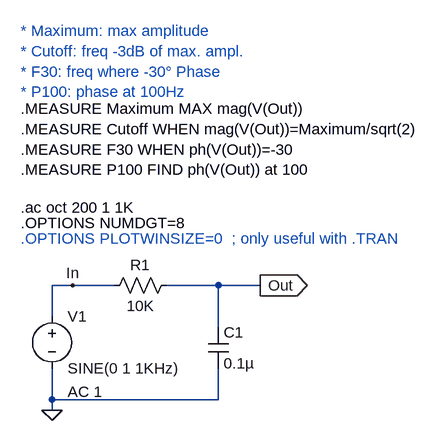
[diagram p0: schematic Phase_shift_lowpass1.asc]
Phase_shift_lowpass1.asc, the LTspice schematic file:
Version 4
SHEET 1 1544 680
WIRE 48 112 16 112
WIRE 112 112 48 112
WIRE 272 112 192 112
WIRE 336 112 272 112
WIRE 16 160 16 112
WIRE 272 176 272 112
WIRE 16 288 16 240
WIRE 272 288 272 240
WIRE 272 288 16 288
WIRE 16 304 16 288
FLAG 16 304 0
FLAG 336 112 Out
IOPIN 336 112 Out
FLAG 48 112 In
SYMBOL res 96 128 R270
WINDOW 0 32 56 VTop 0
WINDOW 3 0 56 VBottom 0
SYMATTR InstName R1
SYMATTR Value 10K
SYMBOL cap 256 176 R0
SYMATTR InstName C1
SYMATTR Value 0.1µ
SYMBOL voltage 16 144 R0
WINDOW 123 24 132 Left 0
WINDOW 39 0 0 Left 0
SYMATTR Value2 AC 1
SYMATTR InstName V1
SYMATTR Value SINE(0 1 1KHz)
TEXT -32 -8 Left 0 !.ac oct 200 1 1K
TEXT -32 -160 Left 0 !.MEASURE Maximum MAX mag(V(Out))\n.MEASURE Cutoff WHEN mag(V(Out))=Maximum/sqrt(2)\n.MEASURE F30 WHEN ph(V(Out))=-30\n.MEASURE P100 FIND ph(V(Out)) at 100
TEXT -32 16 Left 0 !.OPTIONS NUMDGT=8
TEXT -32 -280 Left 0 ;* Maximum: max amplitude \n* Cutoff: freq -3dB of max. ampl.\n* F30: freq where -30° Phase\n* P100: phase at 100Hz
TEXT -32 40 Left 0 ;.OPTIONS PLOTWINSIZE=0  ; only useful with .TRAN

The netlist it stands for:
* Phase_shift_lowpass1.asc
R1 In Out 10K
C1 Out 0 0.1µ
V1 In 0 SINE(0 1 1KHz) AC 1
.ac oct 200 1 1K
.MEASURE Maximum MAX mag(V(Out))
.MEASURE Cutoff WHEN mag(V(Out))=Maximum/sqrt(2)
.MEASURE F30 WHEN ph(V(Out))=-30
.MEASURE P100 FIND ph(V(Out)) at 100
.OPTIONS NUMDGT=8
* * Maximum: max amplitude
* * Cutoff: freq -3dB of max. ampl.
* * F30: freq where -30° Phase
* * P100: phase at 100Hz
* .OPTIONS PLOTWINSIZE=0  ; only useful with .TRAN
.backanno
.end